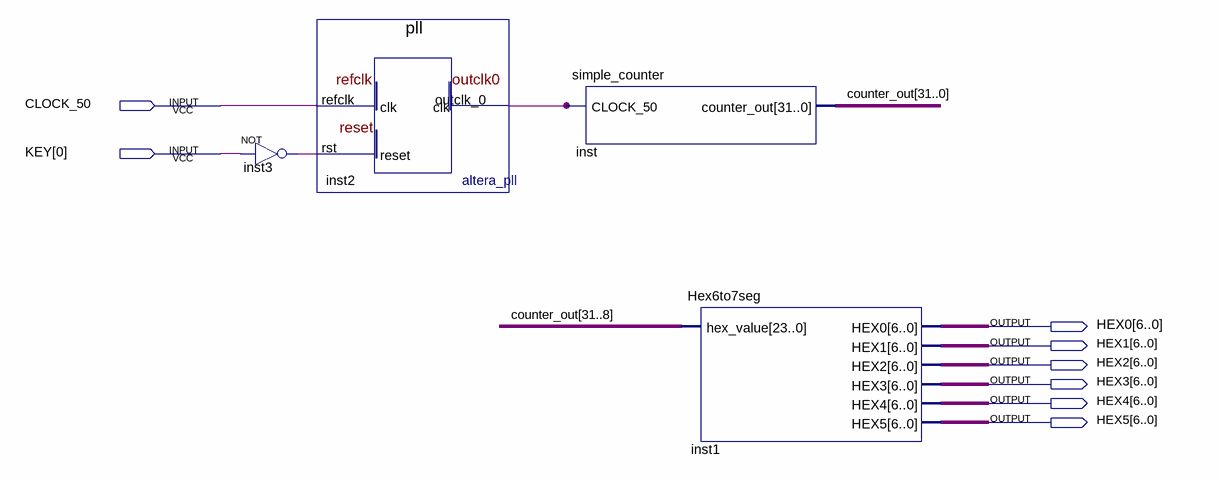
[diagram p0: schematic sheet]
// Quartus schematic fpga_Project.bdf as structural Verilog: 4 symbols, 8 pins
module fpga_Project (
  input  CLOCK_50,
  input  [0:0] KEY,
  output [6:0] HEX0,
  output [6:0] HEX1,
  output [6:0] HEX2,
  output [6:0] HEX3,
  output [6:0] HEX4,
  output [6:0] HEX5
);

  wire inst2_outclk_0, inst3_out;
  wire [31:0] counter_out;

  not inst3 (inst3_out, KEY[0]);
  pll inst2 (.refclk(CLOCK_50), .rst(inst3_out), .outclk_0(inst2_outclk_0));
  simple_counter inst (.CLOCK_50(inst2_outclk_0), .counter_out(counter_out));
  Hex6to7seg inst1 (
    .hex_value(counter_out[31:8]), .HEX0(HEX0), .HEX1(HEX1), .HEX2(HEX2), .HEX3(HEX3), .HEX4(HEX4),
    .HEX5(HEX5));
endmodule
